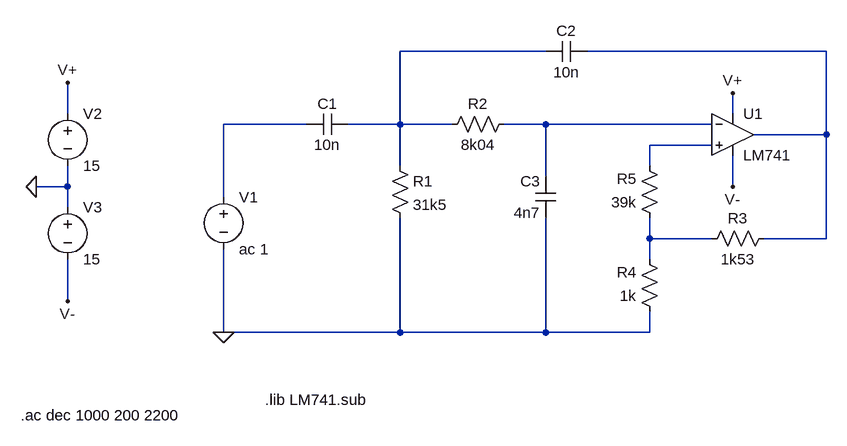
[diagram p0: schematic Aktives Filter.asc]
Aktives Filter.asc, the LTspice schematic file:
Version 4
SHEET 1 880 680
WIRE 400 16 176 16
WIRE 832 16 464 16
WIRE -336 112 -336 64
WIRE 688 112 688 80
WIRE 32 128 -96 128
WIRE 176 128 176 16
WIRE 176 128 96 128
WIRE 256 128 176 128
WIRE 400 128 336 128
WIRE 656 128 400 128
WIRE 832 144 832 16
WIRE 832 144 720 144
WIRE 656 160 560 160
WIRE 176 192 176 128
WIRE 560 192 560 160
WIRE 400 208 400 128
WIRE -336 224 -336 192
WIRE -336 224 -384 224
WIRE 688 224 688 176
WIRE -96 240 -96 128
WIRE -336 256 -336 224
WIRE 560 304 560 272
WIRE 656 304 560 304
WIRE 832 304 832 144
WIRE 832 304 736 304
WIRE 560 336 560 304
WIRE -336 400 -336 336
WIRE -96 448 -96 320
WIRE 176 448 176 272
WIRE 176 448 -96 448
WIRE 400 448 400 272
WIRE 400 448 176 448
WIRE 560 448 560 416
WIRE 560 448 400 448
FLAG -96 448 0
FLAG -384 224 0
FLAG -336 64 V+
FLAG 688 80 V+
FLAG -336 400 V-
FLAG 688 224 V-
SYMBOL cap 96 112 R90
WINDOW 0 0 32 VBottom 2
WINDOW 3 32 32 VTop 2
SYMATTR InstName C1
SYMATTR Value 10n
SYMBOL cap 464 0 R90
WINDOW 0 0 32 VBottom 2
WINDOW 3 32 32 VTop 2
SYMATTR InstName C2
SYMATTR Value 10n
SYMBOL cap 416 272 R180
WINDOW 0 24 56 Left 2
WINDOW 3 24 8 Left 2
SYMATTR InstName C3
SYMATTR Value 4n7
SYMBOL res 160 176 R0
SYMATTR InstName R1
SYMATTR Value 31k5
SYMBOL res 352 112 R90
WINDOW 0 0 56 VBottom 2
WINDOW 3 32 56 VTop 2
SYMATTR InstName R2
SYMATTR Value 8k04
SYMBOL res 752 288 R90
WINDOW 0 0 56 VBottom 2
WINDOW 3 32 56 VTop 2
SYMATTR InstName R3
SYMATTR Value 1k53
SYMBOL res 576 432 R180
WINDOW 0 36 76 Left 2
WINDOW 3 36 40 Left 2
SYMATTR InstName R4
SYMATTR Value 1k
SYMBOL res 576 288 R180
WINDOW 0 36 76 Left 2
WINDOW 3 36 40 Left 2
SYMATTR InstName R5
SYMATTR Value 39k
SYMBOL Opamps\\opamp2 688 80 R0
SYMATTR InstName U1
SYMATTR Value LM741
SYMBOL voltage -96 224 R0
WINDOW 123 0 0 Left 2
WINDOW 39 0 0 Left 2
SYMATTR InstName V1
SYMATTR Value ac 1
SYMBOL voltage -336 96 R0
WINDOW 123 0 0 Left 2
WINDOW 39 0 0 Left 2
SYMATTR InstName V2
SYMATTR Value 15
SYMBOL voltage -336 240 R0
WINDOW 123 0 0 Left 2
WINDOW 39 0 0 Left 2
SYMATTR InstName V3
SYMATTR Value 15
TEXT -32 552 Left 2 !.lib LM741.sub
TEXT -408 576 Left 2 !.ac dec 1000 200 2200

The netlist it stands for:
* Aktives Filter.asc
C1 N001 N003 10n
C2 N002 N001 10n
C3 0 N004 4n7
R1 N001 0 31k5
R2 N004 N001 8k04
R3 N002 N006 1k53
R4 0 N006 1k
R5 N006 N005 39k
XU1 N005 N004 V+ V- N002 LM741  ; pins In+ In- V+ V- OUT
V1 N003 0 ac 1
V2 V+ 0 15
V3 0 V- 15
.lib LM741.sub
.ac dec 1000 200 2200
.backanno
.end